# EAGLE design H1DR0x-AT (EAGLE 9.6.0)
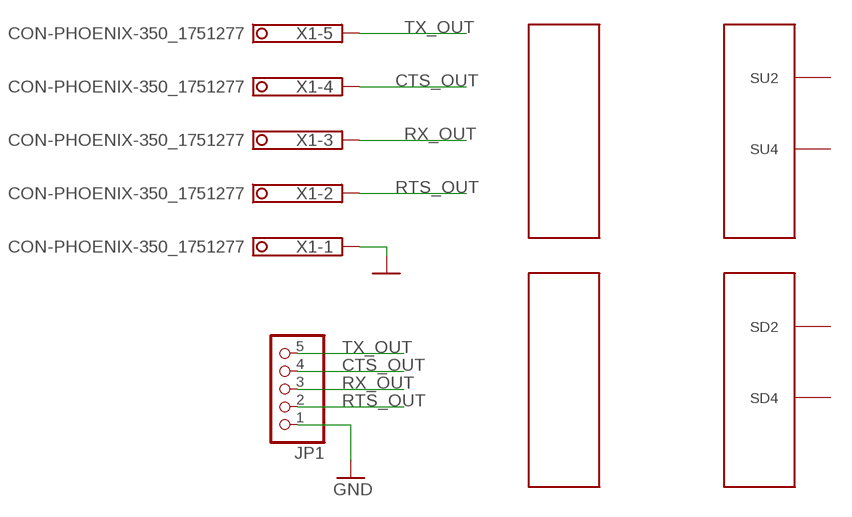
[diagram p0: schematic, sheet 1]

## Parts
JP1  PINHD-1X5  [F_1X05]
U$1  HEXABIT_BUS_ADAPTER_WITH_PD2_PD4_PD9_PD10  [HEXABIT_BUS_ADAPTER_WITH_P2_P4]
X1  CON-PHOENIX-350_1751277  [CON-PHOENIX-350_1751277]

## Nets
CTS_OUT: JP1.4 X1.4
GND: JP1.1 X1.1
RTS_OUT: JP1.2 X1.2
RX_OUT: JP1.3 X1.3
TX_OUT: JP1.5 X1.5
Unconnected: U$1.PAD_PD2(SD2) U$1.PAD_PD4(SD4) U$1.PAD_PU2(SU2) U$1.PAD_PU4(SU4)

## Library data of the parts
JP1 = Hexabitz:PINHD-1X5: PIN HEADER Female right angle
U$1 = hexabitz_connectors:HEXABIT_BUS_ADAPTER_WITH_PD2_PD4_PD9_PD10
X1 = Hexabitz:CON-PHOENIX-350_1751277: MKDS 1/ 5-3,5 Printklemme Nennstrom: 10 A Bemessungsspannung: 160 V Raster: 3,5 mm Polzahl: 5 Montageart: Löten Anschlussart: Schraubanschluss Anschlussrichtung vom Leiter zur Platine: 0° Source: http://eshop.phoenixcontact.com .. 1751277.pdf; OC_FARNELL: unknown; OC_NEWARK: unknown

## Board
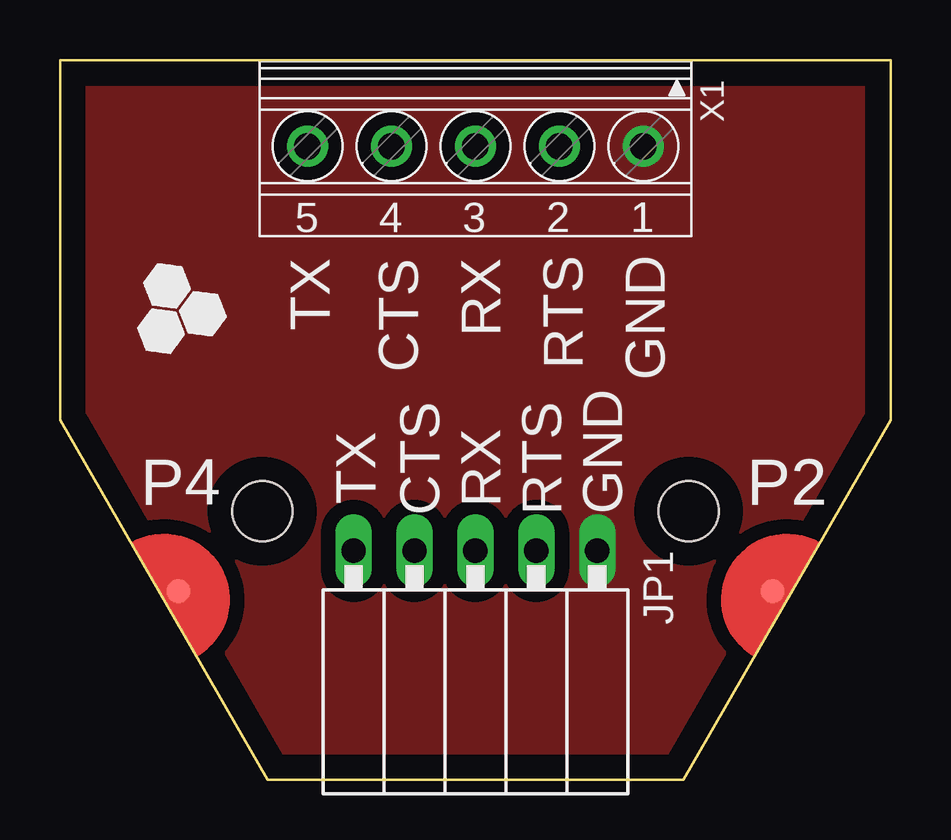
[diagram p1: board, top side]
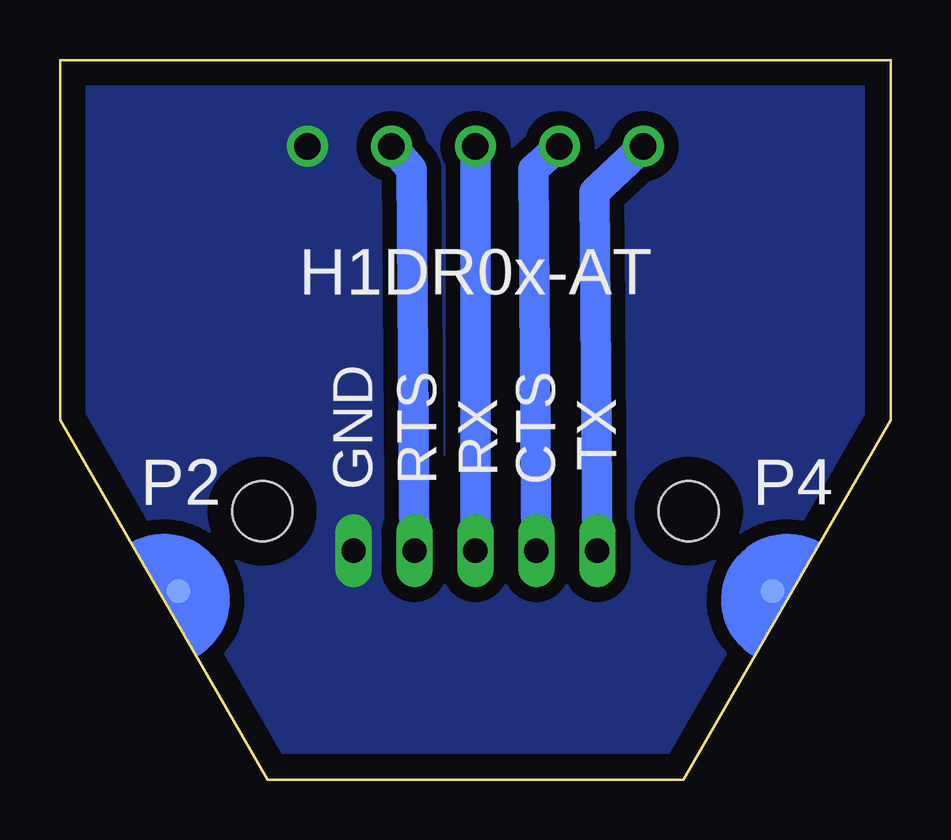
[diagram p2: board, bottom side, seen from below]

Size 34.64 x 30 mm. Coordinates in mm from the lower left corner, seen from the top.
Copper layers (1*16): Top 0.035mm / dielectric 0.15mm / Bottom 0.035mm
Design rules "default": minimum track width 6mil, minimum drill 0.35mm, track to track 6mil, track to pad 6mil, pad to pad 6mil, via to via 6mil, smd to smd 6mil, copper to edge 40mil, drill to drill 6mil, minimum pad ring 10mil, minimum via ring 8mil, stop-mask expansion 4mil, vias tented up to drill 0mil, thermal gap 10mil

### Footprints (pad centres in the part's own frame; a part is rotated, then mirrored left to right if it is on the bottom)
F_1X05 = drill 1.016 long: 1 -5.08,-2.54; 2 -2.54,-2.54; 3 0,-2.54; 4 2.54,-2.54; 5 5.08,-2.54
HEXABIT_BUS_ADAPTER_WITH_P2_P4 = smd 1 x 1 bottom: PAD_PD2 12.39,-7.15; PAD_PD4 -12.39,-7.15 | smd 1 x 1: PAD_PU2 12.39,-7.15; PAD_PU4 -12.39,-7.15 | hole 2.5: -8.89,-3.81; 8.89,-3.81
CON-PHOENIX-350_1751277 = drill 1.1 pad 1.7: 1 -7,-0.1; 2 -3.5,-0.1; 3 0,-0.1; 4 3.5,-0.1; 5 7,-0.1

### Placement (x,y rotation side)
JP1  17.32,7 180 top
U$1  17.32,15 0 top
X1  17.32,26.3 180 top

### Tracks (layer width: path | path; a pad name or v marks a point on that pad's centre or on a via)
CTS_OUT
  Bottom 1.27: JP1.4 14.91,25.44 X1.4
GND
  pour Bottom (isolate 0.61, no thermals): 34.59,29.99 0.05,29.99 0.05,0.01 34.59,0.01
  pour Top (isolate 0.61, no thermals): 0.05,29.99 0.05,0.01 34.59,0.01 34.59,29.99
RTS_OUT
  Bottom 1.27: X1.2 19.99,25.44 JP1.2
RX_OUT
  Bottom 1.27: JP1.3 X1.3
TX_OUT
  Bottom 1.27: JP1.5 12.37,24.48 X1.5

### Text on the board
tPlace: TX | CTS | RX | RTS | GND | CTS | RTS | GND | TX | RX | P4 | P2
bPlace: H1DR0x-AT | CTS | RTS | GND | TX | RX | P4 | P2